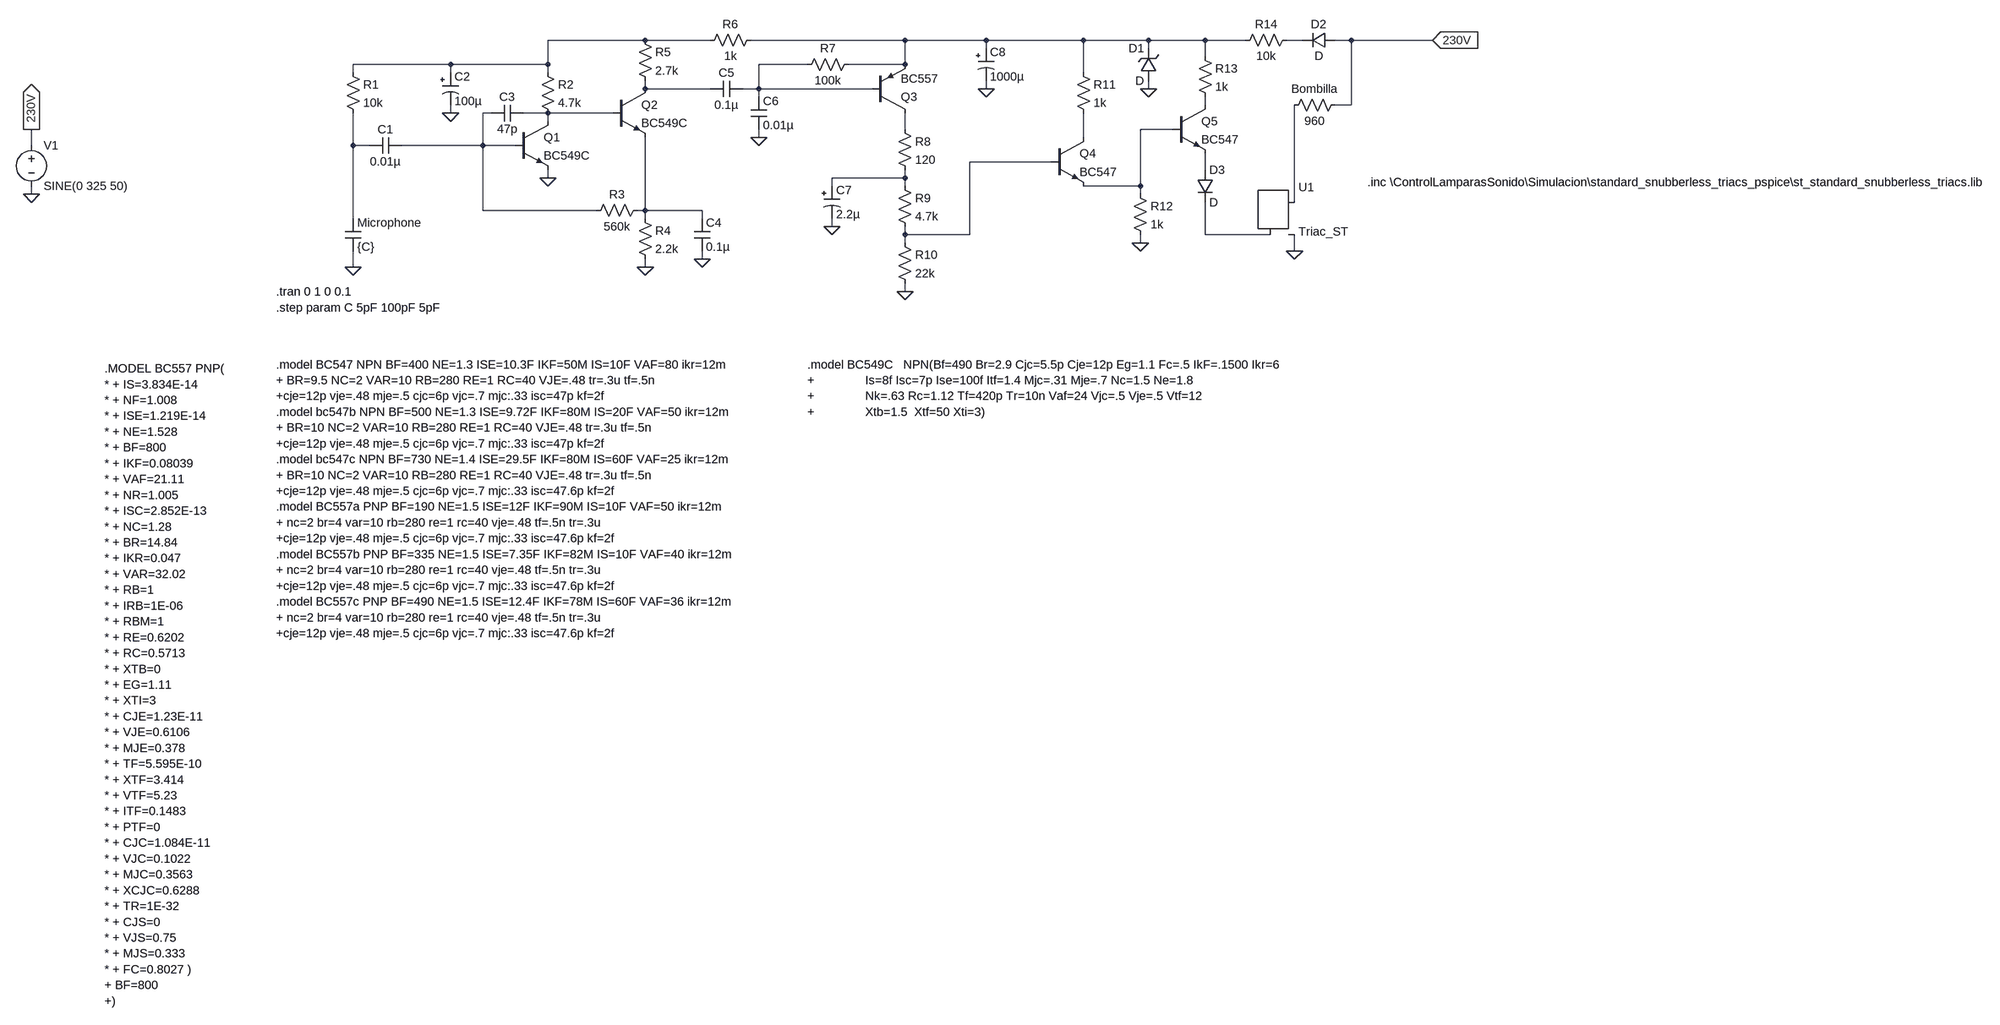
[diagram p0: schematic SimulacionSPICE.asc]
SimulacionSPICE.asc, the LTspice schematic file:
Version 4
SHEET 1 4560 1696
WIRE 1344 -112 1152 -112
WIRE 1472 -112 1344 -112
WIRE 1856 -112 1552 -112
WIRE 2016 -112 1856 -112
WIRE 2208 -112 2016 -112
WIRE 2336 -112 2208 -112
WIRE 2448 -112 2336 -112
WIRE 2528 -112 2448 -112
WIRE 2640 -112 2608 -112
WIRE 2736 -112 2704 -112
WIRE 2896 -112 2736 -112
WIRE 2016 -96 2016 -112
WIRE 2336 -96 2336 -112
WIRE 2448 -80 2448 -112
WIRE 960 -64 768 -64
WIRE 1152 -64 1152 -112
WIRE 1152 -64 960 -64
WIRE 1664 -64 1568 -64
WIRE 1856 -64 1856 -112
WIRE 1856 -64 1744 -64
WIRE 768 -48 768 -64
WIRE 960 -48 960 -64
WIRE 1152 -48 1152 -64
WIRE 2208 -48 2208 -112
WIRE 1344 -16 1344 -32
WIRE 1472 -16 1344 -16
WIRE 1568 -16 1568 -64
WIRE 1568 -16 1536 -16
WIRE 1792 -16 1568 -16
WIRE 2016 -16 2016 -32
WIRE 2336 -16 2336 -32
WIRE 1568 0 1568 -16
WIRE 2448 16 2448 0
WIRE 2736 16 2736 -112
WIRE 2736 16 2704 16
WIRE 960 32 960 16
WIRE 1040 32 1024 32
WIRE 1152 32 1104 32
WIRE 1280 32 1152 32
WIRE 1152 48 1152 32
WIRE 1856 64 1856 32
WIRE 2384 64 2320 64
WIRE 1568 80 1568 64
WIRE 2208 80 2208 32
WIRE 112 96 112 64
WIRE 768 96 768 32
WIRE 800 96 768 96
WIRE 1024 96 1024 32
WIRE 1024 96 864 96
WIRE 1088 96 1024 96
WIRE 2144 128 1984 128
WIRE 2448 144 2448 112
WIRE 1152 160 1152 144
WIRE 1856 160 1856 144
WIRE 1856 160 1712 160
WIRE 1712 176 1712 160
WIRE 1856 176 1856 160
WIRE 2320 176 2320 64
WIRE 2320 176 2208 176
WIRE 112 192 112 176
WIRE 2320 192 2320 176
WIRE 2624 208 2624 16
WIRE 1024 224 1024 96
WIRE 1248 224 1024 224
WIRE 1344 224 1344 80
WIRE 1344 224 1328 224
WIRE 1456 224 1344 224
WIRE 768 240 768 96
WIRE 1344 240 1344 224
WIRE 1456 240 1456 224
WIRE 1712 256 1712 240
WIRE 1856 272 1856 256
WIRE 1984 272 1984 128
WIRE 1984 272 1856 272
WIRE 2448 272 2448 208
WIRE 2576 272 2448 272
WIRE 1856 288 1856 272
WIRE 2320 288 2320 272
WIRE 2624 304 2624 272
WIRE 1456 320 1456 304
WIRE 768 336 768 304
WIRE 1344 336 1344 320
WIRE 1856 384 1856 368
FLAG 112 192 0
FLAG 112 64 230V
IOPIN 112 64 Out
FLAG 960 32 0
FLAG 768 336 0
FLAG 1152 160 0
FLAG 1344 336 0
FLAG 1456 320 0
FLAG 1568 80 0
FLAG 1856 384 0
FLAG 1712 256 0
FLAG 2016 -16 0
FLAG 2320 288 0
FLAG 2336 -16 0
FLAG 2896 -112 230V
IOPIN 2896 -112 In
FLAG 2624 304 0
SYMBOL voltage 112 80 R0
WINDOW 123 0 0 Left 0
WINDOW 39 0 0 Left 0
SYMATTR InstName V1
SYMATTR Value SINE(0 325 50)
SYMBOL cap 752 240 R0
SYMATTR InstName Microphone
SYMATTR Value {C}
SYMBOL cap 864 80 R90
WINDOW 0 0 32 VBottom 2
WINDOW 3 32 32 VTop 2
SYMATTR InstName C1
SYMATTR Value 0.01µ
SYMBOL res 752 -64 R0
SYMATTR InstName R1
SYMATTR Value 10k
SYMBOL polcap 944 -48 R0
SYMATTR InstName C2
SYMATTR Value 100µ
SYMATTR SpiceLine V=25
SYMBOL npn 1088 48 R0
SYMATTR InstName Q1
SYMATTR Value BC549C
SYMBOL res 1136 -64 R0
SYMATTR InstName R2
SYMATTR Value 4.7k
SYMBOL cap 1104 16 R90
WINDOW 0 0 32 VBottom 2
WINDOW 3 32 32 VTop 2
SYMATTR InstName C3
SYMATTR Value 47p
SYMBOL res 1344 208 R90
WINDOW 0 0 56 VBottom 2
WINDOW 3 32 56 VTop 2
SYMATTR InstName R3
SYMATTR Value 560k
SYMBOL res 1328 224 R0
SYMATTR InstName R4
SYMATTR Value 2.2k
SYMBOL cap 1440 240 R0
SYMATTR InstName C4
SYMATTR Value 0.1µ
SYMBOL npn 1280 -16 R0
SYMATTR InstName Q2
SYMATTR Value BC549C
SYMBOL res 1328 -128 R0
SYMATTR InstName R5
SYMATTR Value 2.7k
SYMBOL cap 1536 -32 R90
WINDOW 0 0 32 VBottom 2
WINDOW 3 32 32 VTop 2
SYMATTR InstName C5
SYMATTR Value 0.1µ
SYMBOL cap 1552 0 R0
SYMATTR InstName C6
SYMATTR Value 0.01µ
SYMBOL res 1568 -128 R90
WINDOW 0 0 56 VBottom 2
WINDOW 3 32 56 VTop 2
SYMATTR InstName R6
SYMATTR Value 1k
SYMBOL res 1760 -80 R90
WINDOW 0 0 56 VBottom 2
WINDOW 3 32 56 VTop 2
SYMATTR InstName R7
SYMATTR Value 100k
SYMBOL pnp 1792 32 M180
SYMATTR InstName Q3
SYMATTR Value BC557
SYMBOL res 1840 48 R0
SYMATTR InstName R8
SYMATTR Value 120
SYMBOL res 1840 160 R0
SYMATTR InstName R9
SYMATTR Value 4.7k
SYMBOL res 1840 272 R0
SYMATTR InstName R10
SYMATTR Value 22k
SYMBOL polcap 1696 176 R0
SYMATTR InstName C7
SYMATTR Value 2.2µ
SYMATTR SpiceLine V=25
SYMBOL polcap 2000 -96 R0
SYMATTR InstName C8
SYMATTR Value 1000µ
SYMATTR SpiceLine V=25
SYMBOL npn 2144 80 R0
SYMATTR InstName Q4
SYMATTR Value BC547
SYMBOL res 2192 -64 R0
SYMATTR InstName R11
SYMATTR Value 1k
SYMBOL res 2304 176 R0
SYMATTR InstName R12
SYMATTR Value 1k
SYMBOL npn 2384 16 R0
SYMATTR InstName Q5
SYMATTR Value BC547
SYMBOL zener 2352 -32 R180
WINDOW 0 24 64 Left 2
WINDOW 3 24 0 Left 2
SYMATTR InstName D1
SYMBOL res 2432 -96 R0
SYMATTR InstName R13
SYMATTR Value 1k
SYMBOL res 2624 -128 R90
WINDOW 0 0 56 VBottom 2
WINDOW 3 32 56 VTop 2
SYMATTR InstName R14
SYMATTR Value 10k
SYMATTR SpiceLine pwr=5
SYMBOL diode 2704 -128 R90
WINDOW 0 0 32 VBottom 2
WINDOW 3 32 32 VTop 2
SYMATTR InstName D2
SYMBOL diode 2432 144 R0
SYMATTR InstName D3
SYMBOL res 2720 0 R90
WINDOW 0 0 56 VBottom 2
WINDOW 3 32 56 VTop 2
SYMATTR InstName Bombilla
SYMATTR Value 960
SYMBOL Misc\\TRIAC 2592 208 R0
SYMATTR InstName U1
SYMATTR Value Triac_ST
TEXT 1664 528 Left 2 !.model BC549C   NPN(Bf=490 Br=2.9 Cjc=5.5p Cje=12p Eg=1.1 Fc=.5 IkF=.1500 Ikr=6\n+               Is=8f Isc=7p Ise=100f Itf=1.4 Mjc=.31 Mje=.7 Nc=1.5 Ne=1.8 \n+               Nk=.63 Rc=1.12 Tf=420p Tr=10n Vaf=24 Vjc=.5 Vje=.5 Vtf=12\n+               Xtb=1.5  Xtf=50 Xti=3)
TEXT 256 536 Left 2 !.MODEL BC557 PNP(\n* + IS=3.834E-14\n* + NF=1.008\n* + ISE=1.219E-14\n* + NE=1.528\n* + BF=800\n* + IKF=0.08039\n* + VAF=21.11\n* + NR=1.005\n* + ISC=2.852E-13\n* + NC=1.28\n* + BR=14.84\n* + IKR=0.047\n* + VAR=32.02\n* + RB=1\n* + IRB=1E-06\n* + RBM=1\n* + RE=0.6202\n* + RC=0.5713\n* + XTB=0\n* + EG=1.11\n* + XTI=3\n* + CJE=1.23E-11\n* + VJE=0.6106\n* + MJE=0.378\n* + TF=5.595E-10\n* + XTF=3.414\n* + VTF=5.23\n* + ITF=0.1483\n* + PTF=0\n* + CJC=1.084E-11\n* + VJC=0.1022\n* + MJC=0.3563\n* + XCJC=0.6288\n* + TR=1E-32\n* + CJS=0\n* + VJS=0.75\n* + MJS=0.333\n* + FC=0.8027 )\n+ BF=800\n+)
TEXT 616 528 Left 2 !.model BC547 NPN BF=400 NE=1.3 ISE=10.3F IKF=50M IS=10F VAF=80 ikr=12m\n+ BR=9.5 NC=2 VAR=10 RB=280 RE=1 RC=40 VJE=.48 tr=.3u tf=.5n\n+cje=12p vje=.48 mje=.5 cjc=6p vjc=.7 mjc:.33 isc=47p kf=2f\n.model bc547b NPN BF=500 NE=1.3 ISE=9.72F IKF=80M IS=20F VAF=50 ikr=12m\n+ BR=10 NC=2 VAR=10 RB=280 RE=1 RC=40 VJE=.48 tr=.3u tf=.5n\n+cje=12p vje=.48 mje=.5 cjc=6p vjc=.7 mjc:.33 isc=47p kf=2f\n.model bc547c NPN BF=730 NE=1.4 ISE=29.5F IKF=80M IS=60F VAF=25 ikr=12m\n+ BR=10 NC=2 VAR=10 RB=280 RE=1 RC=40 VJE=.48 tr=.3u tf=.5n\n+cje=12p vje=.48 mje=.5 cjc=6p vjc=.7 mjc:.33 isc=47.6p kf=2f\n.model BC557a PNP BF=190 NE=1.5 ISE=12F IKF=90M IS=10F VAF=50 ikr=12m\n+ nc=2 br=4 var=10 rb=280 re=1 rc=40 vje=.48 tf=.5n tr=.3u\n+cje=12p vje=.48 mje=.5 cjc=6p vjc=.7 mjc:.33 isc=47.6p kf=2f\n.model BC557b PNP BF=335 NE=1.5 ISE=7.35F IKF=82M IS=10F VAF=40 ikr=12m\n+ nc=2 br=4 var=10 rb=280 re=1 rc=40 vje=.48 tf=.5n tr=.3u\n+cje=12p vje=.48 mje=.5 cjc=6p vjc=.7 mjc:.33 isc=47.6p kf=2f\n.model BC557c PNP BF=490 NE=1.5 ISE=12.4F IKF=78M IS=60F VAF=36 ikr=12m\n+ nc=2 br=4 var=10 rb=280 re=1 rc=40 vje=.48 tf=.5n tr=.3u\n+cje=12p vje=.48 mje=.5 cjc=6p vjc=.7 mjc:.33 isc=47.6p kf=2f
TEXT 616 416 Left 2 !.step param C 5pF 100pF 5pF
TEXT 616 384 Left 2 !.tran 0 1 0 0.1
TEXT 2768 168 Left 2 !.inc \\ControlLamparasSonido\\Simulacion\\standard_snubberless_triacs_pspice\\st_standard_snubberless_triacs.lib

The netlist it stands for:
* SimulacionSPICE.asc
V1 230V 0 SINE(0 325 50)
C§Microphone N012 0 {C}
C1 N007 N012 0.01µ
R1 N001 N012 10k
C2 N001 0 100µ V=25
Q1 N008 N007 0 0 BC549C
R2 N001 N008 4.7k
C3 N008 N007 47p
R3 N017 N007 560k
R4 N017 0 2.2k
C4 N017 0 0.1µ
Q2 N005 N008 N017 0 BC549C
R5 N001 N005 2.7k
C5 N004 N005 0.1µ
C6 N004 0 0.01µ
R6 N002 N001 1k
R7 N002 N004 100k
Q3 N009 N004 N002 0 BC557
R8 N009 N015 120
R9 N015 N013 4.7k
R10 N013 0 22k
C7 N015 0 2.2µ V=25
C8 N002 0 1000µ V=25
Q4 N011 N013 N010 0 BC547
R11 N002 N011 1k
R12 N010 0 1k
Q5 N006 N010 N014 0 BC547
D1 0 N002 D
R13 N002 N006 1k
R14 N003 N002 10k pwr=5
D2 230V N003 D
D3 N014 N018 D
R§Bombilla 230V N016 960
XU1 N016 N018 0 Triac_ST  ; pins MT2 G MT1
.model D D
.lib standard.dio
.model NPN NPN
.model PNP PNP
.lib standard.bjt
.model BC549C   NPN(Bf=490 Br=2.9 Cjc=5.5p Cje=12p Eg=1.1 Fc=.5 IkF=.1500 Ikr=6
+               Is=8f Isc=7p Ise=100f Itf=1.4 Mjc=.31 Mje=.7 Nc=1.5 Ne=1.8
+               Nk=.63 Rc=1.12 Tf=420p Tr=10n Vaf=24 Vjc=.5 Vje=.5 Vtf=12
+               Xtb=1.5  Xtf=50 Xti=3)
.MODEL BC557 PNP(
* + IS=3.834E-14
* + NF=1.008
* + ISE=1.219E-14
* + NE=1.528
* + BF=800
* + IKF=0.08039
* + VAF=21.11
* + NR=1.005
* + ISC=2.852E-13
* + NC=1.28
* + BR=14.84
* + IKR=0.047
* + VAR=32.02
* + RB=1
* + IRB=1E-06
* + RBM=1
* + RE=0.6202
* + RC=0.5713
* + XTB=0
* + EG=1.11
* + XTI=3
* + CJE=1.23E-11
* + VJE=0.6106
* + MJE=0.378
* + TF=5.595E-10
* + XTF=3.414
* + VTF=5.23
* + ITF=0.1483
* + PTF=0
* + CJC=1.084E-11
* + VJC=0.1022
* + MJC=0.3563
* + XCJC=0.6288
* + TR=1E-32
* + CJS=0
* + VJS=0.75
* + MJS=0.333
* + FC=0.8027 )
+ BF=800
+)
.model BC547 NPN BF=400 NE=1.3 ISE=10.3F IKF=50M IS=10F VAF=80 ikr=12m
+ BR=9.5 NC=2 VAR=10 RB=280 RE=1 RC=40 VJE=.48 tr=.3u tf=.5n
+cje=12p vje=.48 mje=.5 cjc=6p vjc=.7 mjc:.33 isc=47p kf=2f
.model bc547b NPN BF=500 NE=1.3 ISE=9.72F IKF=80M IS=20F VAF=50 ikr=12m
+ BR=10 NC=2 VAR=10 RB=280 RE=1 RC=40 VJE=.48 tr=.3u tf=.5n
+cje=12p vje=.48 mje=.5 cjc=6p vjc=.7 mjc:.33 isc=47p kf=2f
.model bc547c NPN BF=730 NE=1.4 ISE=29.5F IKF=80M IS=60F VAF=25 ikr=12m
+ BR=10 NC=2 VAR=10 RB=280 RE=1 RC=40 VJE=.48 tr=.3u tf=.5n
+cje=12p vje=.48 mje=.5 cjc=6p vjc=.7 mjc:.33 isc=47.6p kf=2f
.model BC557a PNP BF=190 NE=1.5 ISE=12F IKF=90M IS=10F VAF=50 ikr=12m
+ nc=2 br=4 var=10 rb=280 re=1 rc=40 vje=.48 tf=.5n tr=.3u
+cje=12p vje=.48 mje=.5 cjc=6p vjc=.7 mjc:.33 isc=47.6p kf=2f
.model BC557b PNP BF=335 NE=1.5 ISE=7.35F IKF=82M IS=10F VAF=40 ikr=12m
+ nc=2 br=4 var=10 rb=280 re=1 rc=40 vje=.48 tf=.5n tr=.3u
+cje=12p vje=.48 mje=.5 cjc=6p vjc=.7 mjc:.33 isc=47.6p kf=2f
.model BC557c PNP BF=490 NE=1.5 ISE=12.4F IKF=78M IS=60F VAF=36 ikr=12m
+ nc=2 br=4 var=10 rb=280 re=1 rc=40 vje=.48 tf=.5n tr=.3u
+cje=12p vje=.48 mje=.5 cjc=6p vjc=.7 mjc:.33 isc=47.6p kf=2f
.step param C 5pF 100pF 5pF
.tran 0 1 0 0.1
.inc \ControlLamparasSonido\Simulacion\standard_snubberless_triacs_pspice\st_standard_snubberless_triacs.lib
.backanno
.end